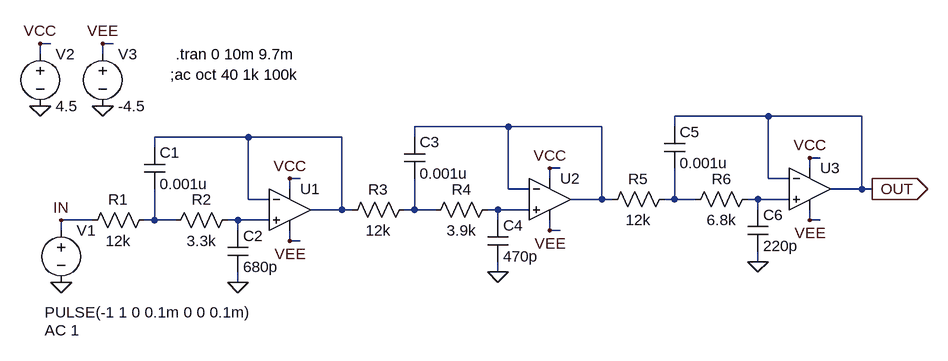
[diagram p0: schematic Nucleo_DCO_LFO_VCVS_6th_Bessel_20kHz@10kHzSaw.asc]
Nucleo_DCO_LFO_VCVS_6th_Bessel_20kHz@10kHzSaw.asc, the LTspice schematic file:
Version 4
SHEET 1 2020 680
WIRE 176 -240 160 -240
WIRE 272 -240 256 -240
WIRE 160 -224 160 -240
WIRE 256 -224 256 -240
WIRE 1280 -128 1136 -128
WIRE 1424 -128 1280 -128
WIRE 880 -112 736 -112
WIRE 1024 -112 880 -112
WIRE 1136 -112 1136 -128
WIRE 480 -96 336 -96
WIRE 624 -96 480 -96
WIRE 736 -96 736 -112
WIRE 336 -80 336 -96
WIRE 1360 -64 1344 -64
WIRE 960 -48 944 -48
WIRE 1344 -48 1344 -64
WIRE 560 -32 544 -32
WIRE 944 -32 944 -48
WIRE 1280 -32 1280 -128
WIRE 1312 -32 1280 -32
WIRE 544 -16 544 -32
WIRE 880 -16 880 -112
WIRE 912 -16 880 -16
WIRE 1424 -16 1424 -128
WIRE 1424 -16 1376 -16
WIRE 1440 -16 1424 -16
WIRE 480 0 480 -96
WIRE 512 0 480 0
WIRE 1024 0 1024 -112
WIRE 1024 0 976 0
WIRE 1040 0 1024 0
WIRE 1136 0 1136 -48
WIRE 1136 0 1120 0
WIRE 1168 0 1136 0
WIRE 1264 0 1248 0
WIRE 1312 0 1264 0
WIRE 624 16 624 -96
WIRE 624 16 576 16
WIRE 640 16 624 16
WIRE 736 16 736 -32
WIRE 736 16 720 16
WIRE 768 16 736 16
WIRE 864 16 848 16
WIRE 912 16 864 16
WIRE 1264 16 1264 0
WIRE 240 32 192 32
WIRE 336 32 336 -16
WIRE 336 32 320 32
WIRE 368 32 336 32
WIRE 464 32 448 32
WIRE 512 32 464 32
WIRE 864 32 864 16
WIRE 1344 32 1344 16
WIRE 1360 32 1344 32
WIRE 192 48 192 32
WIRE 464 48 464 32
WIRE 944 48 944 32
WIRE 960 48 944 48
WIRE 544 64 544 48
WIRE 560 64 544 64
WIRE 1264 96 1264 80
WIRE 864 112 864 96
WIRE 464 128 464 112
FLAG 464 128 0
FLAG 544 -32 VCC
FLAG 544 64 VEE
FLAG 192 128 0
FLAG 160 -144 0
FLAG 256 -144 0
FLAG 160 -240 VCC
FLAG 256 -240 VEE
FLAG 192 32 IN
FLAG 1440 -16 OUT
IOPIN 1440 -16 Out
FLAG 864 112 0
FLAG 944 -48 VCC
FLAG 944 48 VEE
FLAG 1264 96 0
FLAG 1344 -64 VCC
FLAG 1344 32 VEE
SYMBOL voltage 192 32 R0
WINDOW 3 -25 142 Left 2
WINDOW 123 -25 170 Left 2
WINDOW 39 0 0 Left 2
SYMATTR Value PULSE(-1 1 0 0.1m 0 0 0.1m)
SYMATTR Value2 AC 1
SYMATTR InstName V1
SYMBOL res 336 16 R90
WINDOW 0 0 56 VBottom 2
WINDOW 3 32 56 VTop 2
SYMATTR InstName R1
SYMATTR Value 12k
SYMBOL res 464 16 R90
WINDOW 0 0 56 VBottom 2
WINDOW 3 32 56 VTop 2
SYMATTR InstName R2
SYMATTR Value 3.3k
SYMBOL cap 448 48 R0
SYMATTR InstName C2
SYMATTR Value 680p
SYMBOL cap 320 -80 R0
SYMATTR InstName C1
SYMATTR Value 0.001u
SYMBOL Opamps\\UniversalOpamp2 544 16 R0
SYMATTR InstName U1
SYMBOL voltage 160 -240 R0
WINDOW 123 0 0 Left 2
WINDOW 39 0 0 Left 2
SYMATTR InstName V2
SYMATTR Value 4.5
SYMBOL voltage 256 -240 R0
WINDOW 123 0 0 Left 2
WINDOW 39 0 0 Left 2
SYMATTR InstName V3
SYMATTR Value -4.5
SYMBOL res 736 0 R90
WINDOW 0 0 56 VBottom 2
WINDOW 3 32 56 VTop 2
SYMATTR InstName R3
SYMATTR Value 12k
SYMBOL res 864 0 R90
WINDOW 0 0 56 VBottom 2
WINDOW 3 32 56 VTop 2
SYMATTR InstName R4
SYMATTR Value 3.9k
SYMBOL cap 848 32 R0
SYMATTR InstName C4
SYMATTR Value 470p
SYMBOL cap 720 -96 R0
SYMATTR InstName C3
SYMATTR Value 0.001u
SYMBOL Opamps\\UniversalOpamp2 944 0 R0
SYMATTR InstName U2
SYMBOL res 1136 -16 R90
WINDOW 0 0 56 VBottom 2
WINDOW 3 32 56 VTop 2
SYMATTR InstName R5
SYMATTR Value 12k
SYMBOL res 1264 -16 R90
WINDOW 0 0 56 VBottom 2
WINDOW 3 32 56 VTop 2
SYMATTR InstName R6
SYMATTR Value 6.8k
SYMBOL cap 1248 16 R0
SYMATTR InstName C6
SYMATTR Value 220p
SYMBOL cap 1120 -112 R0
SYMATTR InstName C5
SYMATTR Value 0.001u
SYMBOL Opamps\\UniversalOpamp2 1344 -16 R0
SYMATTR InstName U3
TEXT 368 -224 Left 2 !.tran 0 10m 9.7m
TEXT 360 -192 Left 2 !;ac oct 40 1k 100k

The netlist it stands for:
* Nucleo_DCO_LFO_VCVS_6th_Bessel_20kHz@10kHzSaw.asc
V1 IN 0 PULSE(-1 1 0 0.1m 0 0 0.1m) AC 1
R1 N007 IN 12k
R2 N008 N007 3.3k
C2 N008 0 680p
C1 N002 N007 0.001u
XU1 N008 N002 VCC VEE N002 level.2 Avol=1Meg GBW=10Meg Slew=10Meg ilimit=25m rail=0 Vos=0 phimargin=45 en=0 enk=0 in=0 ink=0 Rin=500Meg  ; pins IN+ IN- V+ V- OUT
V2 VCC 0 4.5
V3 VEE 0 -4.5
R3 N005 N002 12k
R4 N006 N005 3.9k
C4 N006 0 470p
C3 N001 N005 0.001u
XU2 N006 N001 VCC VEE N001 level.2 Avol=1Meg GBW=10Meg Slew=10Meg ilimit=25m rail=0 Vos=0 phimargin=45 en=0 enk=0 in=0 ink=0 Rin=500Meg  ; pins IN+ IN- V+ V- OUT
R5 N003 N001 12k
R6 N004 N003 6.8k
C6 N004 0 220p
C5 OUT N003 0.001u
XU3 N004 OUT VCC VEE OUT level.2 Avol=1Meg GBW=10Meg Slew=10Meg ilimit=25m rail=0 Vos=0 phimargin=45 en=0 enk=0 in=0 ink=0 Rin=500Meg  ; pins IN+ IN- V+ V- OUT
.tran 0 10m 9.7m
;ac oct 40 1k 100k
.lib UniversalOpamps2.sub
.backanno
.end